# Altium schematic sheet AMPLIFIER.SchDoc
size A4; SheetNumber: 4; SheetTotal: 4
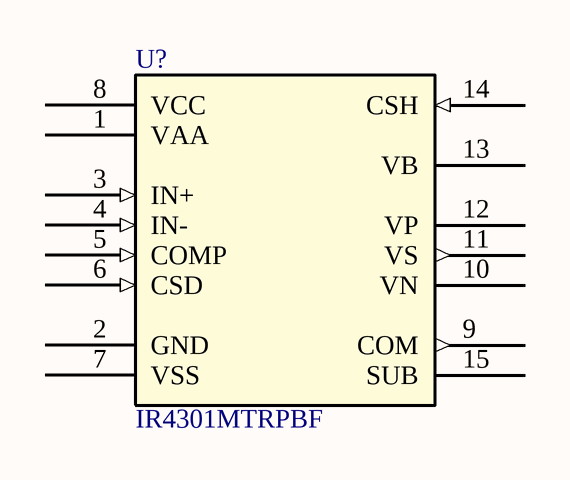
[diagram p0: AMPLIFIER.SchDoc]

## Parts
U?  IR4301MTRPBF  [IR4301MTRPBF-Footprint-1]

## Nets

Not connected (* = marked no-connect by the designer): U? 1(VAA) 2(GND) 3(IN+) 4(IN-) 5(COMP) 6(CSD) 7(VSS) 8(VCC) 9(COM) 10(VN) 11(VS) 12(VP) 13(VB) 14(CSH) 15(SUB)

## Library data of the parts
U? = CMP-014-00006-1: IR4301 Series 15 V Integrated Analog Input Class D Audio Amplifier - PQFN-22